# EasyEDA schematic SCH_Grove_Lepton_camera_2022-09-28.json
TITLE: Grove Flir Lepton module; REV: 1.1; Date: 2022-09-28; Sheet: 1/1; Drawn By: Andrew McFarland; Company: McFly Aerospace\n(Andrew McFarland Networking)
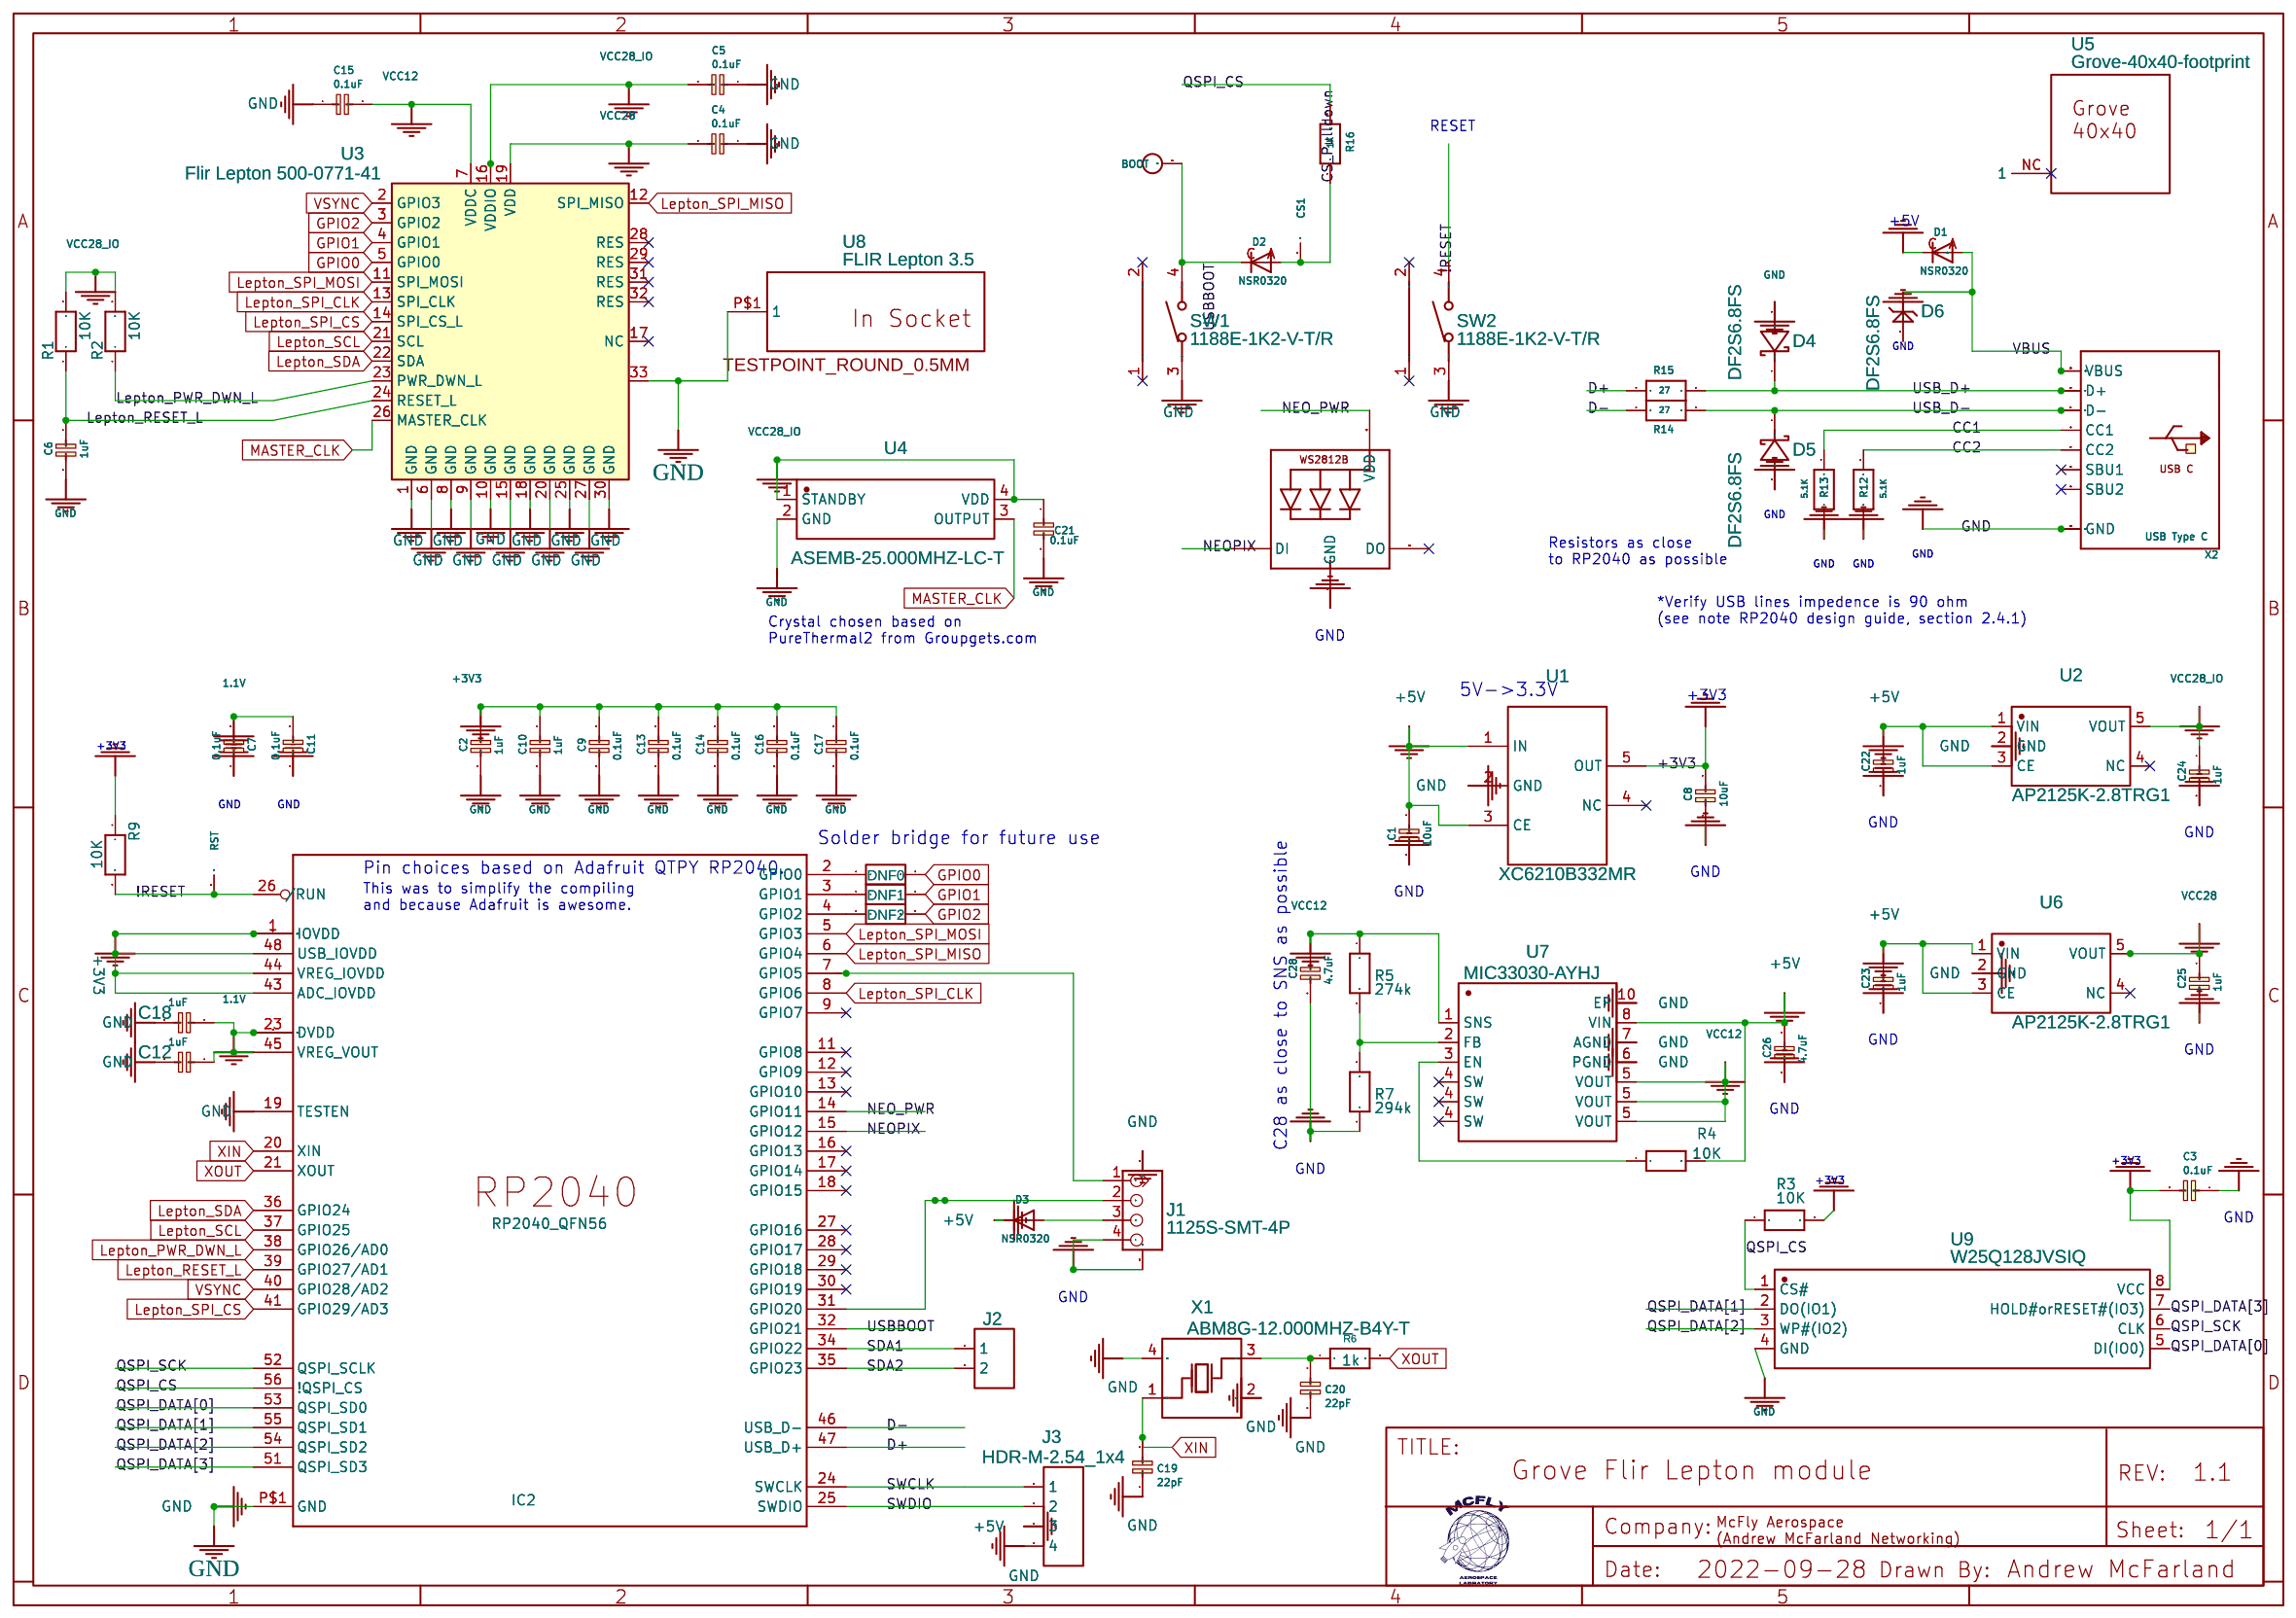
[diagram p0: schematic sheet]

## Parts
BOOT  TESTPOINTROUND1.5MMNO  [TESTPOINT_ROUND_2MM_NO]
C1  10uF  [0805-NO]
C2  1uF  [0603-NO]
C3  0.1uF  [_0402NO]
C4  0.1uF  [_0402NO]
C5  0.1uF  [_0402NO]
C6  1uF  [0603-NO]
C7  0.1uF  [_0402NO]
C8  10uF  [0805-NO]
C9  0.1uF  [_0402NO]
C10  1uF  [0603-NO]
C11  0.1uF  [_0402NO]
C12  1uF  [0603-NO]
C13  0.1uF  [_0402NO]
C14  0.1uF  [_0402NO]
C15  0.1uF  [_0402NO]
C16  0.1uF  [_0402NO]
C17  0.1uF  [_0402NO]
C18  1uF  [0603-NO]
C19  22pF  [_0402NO]
C20  22pF  [_0402NO]
C21  0.1uF  [_0402NO]
C22  1uF  [0603-NO]
C23  1uF  [0603-NO]
C24  1uF  [0603-NO]
C25  1uF  [0603-NO]
C26  4.7uF  [0805-NO]
C28  4.7uF  [0805-NO]
CS1  TESTPOINTROUND1.5MMNO  [TESTPOINT_ROUND_2MM_NO]
D1  NSR0320  [SOD-323]
D2  NSR0320  [SOD-323]
D3  NSR0320  [SOD-323]
D4  DF2S6.8FS  [SOD-923_L0.8-W0.6-LS1.0-RD-1]
D5  DF2S6.8FS  [SOD-923_L0.8-W0.6-LS1.0-RD-1]
D6  DF2S6.8FS  [SOD-923_L0.8-W0.6-LS1.0-BI-2]
DNF0  DNF  [_0402]
DNF1  DNF  [_0402]
DNF2  DNF  [_0402]
IC2  RP2040_QFN56  [QFN56_7MM_REDUCEDEPAD]
J1  1125S-SMT-4P  [HW4-SMD-2.0]
J2  HDR-F-2.54_1x2  [HDR-F-2.54_1X2]
J3  HDR-M-2.54_1x4  [HDR-M-2.54_1X4]
LED1  WS2812B_SK6805_1515  [WS2812B]
R1  10K  [_0402NO]
R2  10K  [_0402NO]
R3  10K  [_0402NO]
R4  10K  [_0402NO]
R5  274k  [_0402NO]
R6  1k  [_0402NO]
R7  294k  [_0402NO]
R9  10K  [_0402NO]
R12  5.1K  [_0402NO]
R13  5.1K  [_0402NO]
R14  27  [0603-MINI]
R15  27  [0603-MINI]
R16  1K  [_0402NO]
RST  TESTPOINTROUND1.5MMNO  [TESTPOINT_ROUND_2MM_NO]
SW1  1188E-1K2-V-T/R  [SW-SMD_1188E]
SW2  1188E-1K2-V-T/R  [SW-SMD_1188E]
U1  XC6210B332MR  [SOT-23-5_L3.0-W1.7-P0.95-LS2.8-BR]
U2  AP2125K-2.8TRG1  [SOT-23-5_L3.0-W1.7-P0.95-LS2.8-BR]
U3  Flir Lepton 500-0771-41  [FLIR_LEPTON_SOCKET_1050281001]
U4  ASEMB-25.000MHZ-LC-T  [OSC-SMD_4P-L3.2-W2.5-BL_ABRACON_ASEMB]
U5  Grove-40x40-footprint  [GROVE-40X40-BOARD]
U6  AP2125K-2.8TRG1  [SOT-23-5_L3.0-W1.7-P0.95-LS2.8-BR]
U7  MIC33030-AYHJ  [QFN-12_L2.5-W2.0-P0.40-TL_MIC33030-AYHJ-TR]
U8  FLIR Lepton 3.5  [TESTPOINT_ROUND_0.5MM]
U9  W25Q128JVSIQ  [SOIC-8_L5.3-W5.3-P1.27-LS8.0-BL]
X1  ABM8G-12.000MHZ-B4Y-T  [CRYSTAL-SMD_4P-L3.2-W2.5-BL]
X2  USB Type C  [USB_C_CUSB31-CFM2AX-01-X]

## Library data of the parts
C1 = -: Supplier: Seeed OPL; Supplier Part: 302010158; Manufacturer: Yageo; Manufacturer Part: CC0805ZKY5V6BB106
C2 = -: Supplier: Seeed OPL; Supplier Part: 302010139; Manufacturer: YAGEO; Manufacturer Part: CC0603KRX7R8BB105
C3 = -: Supplier: Seeed OPL; Supplier Part: 302010004; Manufacturer: YAGEO; Manufacturer Part: CC0402KRX7R7BB104
C20 = -: Supplier: Seeed OPL; Supplier Part: 302010018; Manufacturer: YAGEO; Manufacturer Part: CC0402JRNPO9BN220
C26 = -: Supplier: Seeed OPL; Manufacturer Part: CC0805KKX5R8BB475; Manufacturer: YAGEO; Supplier Part: 302010146
C28 = -: Supplier: Seeed OPL; Supplier Part: 302010146; Manufacturer: YAGEO
D1 = -: Supplier: Digi-Key; Manufacturer: onsemi; Supplier Part: NSR0320MW2T1GOSTR-ND; Manufacturer Part: NSR0320MW2T1G; link: https://www.digikey.cn/short/7tzdmb8c
D2 = -: Supplier: Digi-Key; Supplier Part: NSR0320MW2T1GOSCT-ND; Manufacturer: onsemi; Manufacturer Part: NSR0320MW2T1G; link: https://www.digikey.cn/short/p7r5pnn7
D3 = -: Supplier: Digi-Key; Manufacturer: onsemi; link: https://www.digikey.cn/short/7tzdmb8c; Supplier Part: NSR0320MW2T1GOSCT-ND; Manufacturer Part: NSR0320MW2T1G
D4 = DF2S6.8FS,L3M: Supplier: Seeed OPL; Supplier Part: 304060009; Manufacturer: TOSHIBA(东芝); Contributor: LCSC
D5 = DF2S6.8FS,L3M: Supplier: Seeed OPL; Supplier Part: 304060009; Manufacturer: TOSHIBA(东芝); Contributor: LCSC; link: https://www.mouser.ca/ProductDetail/Toshiba/DF2S6.8FSL3M?qs=eRmS5dli9yOjw7NUk6y8KQ%3D%3D
D6 = D-ESD-2PDF2S6.8FS: SOD-923:304060009;SOD-123:304060001; Supplier: Seeed OPL; Supplier Part: 304060009; Manufacturer: TOSHIBA
DNF0-DNF2 = R_0603_EU: Contributor: LCEDA_Lib
IC2 = -: Supplier: Seeed OPL; Supplier Part: 310011401; Manufacturer: Raspberry Pi; Manufacturer Part: RP2040
J1 = 1125S-SMT-4P: SMD Grove; Manufacturer: Seeed Studio; Supplier: Seeed OPL; Supplier Part: 320110030
J2 = HDR-F-2.54_1x2: Contributor: LCEDA_Lib
J3 = HDR-M-2.54_1x4: Contributor: LCEDA_Lib
LED1 = -: Supplier Part: 304091310; Manufacturer: Worldsemi; Supplier: Seeed OPL; Manufacturer Part: WS2812B-V5
R1 = -: Supplier: Seeed OPL; Manufacturer: YAGEO; Manufacturer Part: RC0402JR-0710KL; Supplier Part: 301010004
R2 R3 R9 = -: Supplier: Seeed OPL; Supplier Part: 301010004; Manufacturer: YAGEO; Manufacturer Part: RC0402JR-0710KL
R4 = -: Supplier: Seeed OPL; Manufacturer Part: RC0402JR-0710KL; Manufacturer: YAGEO; Supplier Part: 301010004
R5 = -: Supplier: ShenZen OPL; Supplier Part: RC0402FR-07274KL; Manufacturer: YAGEO
R6 = -: Supplier: Seeed OPL; Manufacturer Part: RC0402FR-071KL; Manufacturer: YAGEO; Supplier Part: 301010044
R7 = -: Supplier: ShenZen OPL; Supplier Part: RC0402FR-07294KL; Manufacturer: Yageo
R12 = -: Supplier: Seeed OPL; Manufacturer Part: RC0402FR-075K1L; Supplier Part: 301010495; Manufacturer: YAGEO
R13 = -: Manufacturer: YAGEO; Manufacturer Part: RC0402FR-075K1L; Supplier Part: 301010495; Supplier: Seeed OPL
R14 = -: Manufacturer: YAGEO; Supplier: Seeed OPL; Manufacturer Part: RC0603FR-0727RL; Supplier Part: 301011528
R15 = -: Supplier: Seeed OPL; Supplier Part: 301011528; Manufacturer: YAGEO; Manufacturer Part: RC0603FR-0727RL
R16 = -: Manufacturer: YAGEO; Manufacturer Part: RC0402FR-071KL; Supplier Part: 301010044; Supplier: Seeed OPL
SW1 = 1188E-1K2-V-T/R: Supplier: Seeed OPL; Supplier Part: 311020023; Manufacturer: BEST; Contributor: LCSC; JLCPCB Part Class: Extended Part
SW2 = 1188E-1K2-V-T/R: Supplier: Seeed OPL; Supplier Part: 311020023; Manufacturer: Diptronics; Contributor: LCSC; JLCPCB Part Class: Extended Part
U1 = XC6210B332MR: Supplier: ShenZen OPL; Manufacturer: TOREX; Supplier Part: 893-1075-1-ND
U2 = AP2125K-2.8TRG1: Supplier: Digi-Key; Supplier Part: AP2125K-2.8TRG1DICT-ND; Manufacturer: DIODES(美台); Contributor: LCSC; link: https://www.digikey.ca/short/h7r9pdbn
U3 = 500-0643-00: Manufacturer: Molex; Contributor: mike pelletier; Manufacturer Part: 1050281001; Supplier: Digi-Key; link: https://www.digikey.cn/short/3bp81pn2; Supplier Part: WM6827CT-ND
U4 = ASEMB-25.000MHZ-LY-T: Supplier: Digi-Key; Supplier Part: 535-11750-2-ND - 卷带（TR） 535-11750-1-ND; Manufacturer: ABRACON; Manufacturer Part: 535-11750-2-ND - 卷带（TR） 535-11750-1-ND; link: https://www.digikey.cn/zh/products/detail/abracon-llc/ASEMB-25-000MHZ-LC-T/2810004; Contributor: lcsc
U5 = Grove-40x40-footprint: Contributor: andrew26
U6 = AP2125K-2.8TRG1: Supplier: Digi-Key; Supplier Part: AP2125K-2.8TRG1DICT-ND; Manufacturer: DIODES(美台); Contributor: LCSC; link: https://www.digikey.ca/short/jdw2zfbz
U7 = MIC33030-AYHJ-TR: Supplier: Mouser; Supplier Part: 998-MIC33030-AYHJTR; Manufacturer: Microchip Tech; Contributor: LCSC; link: https://mou.sr/3SlIkxG
U8 = lepton: Manufacturer Part: 500-0771-01-ND; Contributor: fcplech; Package Display: Yes; Supplier: Digi-Key; link: https://www.digikey.cn/short/n80ntdbh; Manufacturer: Teledyne Flir; Supplier Part: 500-0771-01
U9 = W25Q128JVSIQ: Supplier: ShenZen OPL; Manufacturer: Winbond Elec; Contributor: LCSC
X1 = ABM8G-12.000MHZ-B4Y-T: Supplier: Digi-Key; Manufacturer: Abracon LLC; Contributor: LCSC; JLCPCB Part Class: Extended Part; link: https://www.digikey.cn/zh/products/detail/abracon-llc/ABM8G-12-000MHZ-B4Y-T/2218029

## Nets
1.1V: C7.2 C11.2 C12.1 C18.1 IC2.23(DVDD) IC2.45(VREG_VOUT) IC2.50(DVDD)
+3V3: C2.1 C3.2 C8.1 C9.1 C10.1 C13.1 C14.1 C16.1 C17.1 IC2.1(IOVDD) IC2.10(IOVDD) IC2.22(IOVDD) IC2.33(IOVDD) IC2.42(IOVDD) IC2.43(ADC_IOVDD) IC2.44(VREG_IOVDD) IC2.48(USB_IOVDD) IC2.49(IOVDD) R3.2 R9.1 U1.5(OUT) U9.8(VCC)
+5V: C1.1 C22.1 C23.1 C26.1 D1.C(Cathode) D3.C J3.3 R4.2 U1.1(IN) U1.3(CE) U2.1(VIN) U2.3(CE) U6.1(VIN) U6.3(CE) U7.8(VIN)
GND: C1.2 C2.2 C3.1 C4.1 C5.1 C6.2 C7.1 C8.2 C9.2 C10.2 C11.1 C12.2 C13.2 C14.2 C15.1 C16.2 C17.2 C18.2 C19.1 C20.2 C21.2 C22.2 C23.2 C24.2 C25.2 C26.2 C28.2 D4.2 D5.2 D6.2(1) IC2.19(TESTEN) IC2.P$1(GND) J1.4 J1.SS1 J1.SS2 J3.4 LED1.3-GND(GND) R7.2 R12.1 R13.1 SW1.3 SW2.3 U1.2(GND) U2.2(GND) U3.1(GND) U3.6(GND) U3.8(GND) U3.9(GND) U3.10(GND) U3.15(GND) U3.18(GND) U3.20(GND) U3.25(GND) U3.27(GND) U3.30(GND) U3.33 U4.2(GND) U6.2(GND) U7.6(PGND) U7.7(AGND) U7.10(EP) U8.P$1(1) U9.4(GND) X1.2(GND) X1.4(GND) X2.A1B12(GND) X2.B1A12(GND)
VBUS: D1.A(Anode) D6.1(2) X2.A4B9(VBUS) X2.B4A9(VBUS)
VCC12: C15.2 C28.1 R5.1 U3.7(VDDC) U7.1(SNS) U7.5(VOUT)
VCC28: C4.2 C25.1 U3.19(VDD) U6.5(VOUT)
VCC28_IO: C5.2 C21.1 C24.1 R1.2 R2.2 U2.5(VOUT) U3.16(VDDIO) U4.1(STANDBY) U4.4(VDD)
!RESET: IC2.26(/RUN) R9.2 RST.P$1 SW2.4
CC1: R13.2 X2.A5(CC1)
CC2: R12.2 X2.B5(CC2)
CS_Pulldown: CS1.P$1 D2.A R16.2
D+: IC2.47(USB_D+) R15.2
D-: IC2.46(USB_D-) R14.2
GPIO0: DNF0.2 U3.5(GPIO0)
GPIO1: DNF1.2 U3.4(GPIO1)
GPIO2: DNF2.2 U3.3(GPIO2)
Lepton_PWR_DWN_L: IC2.38(GPIO26/AD0) R2.1 U3.23(PWR_DWN_L)
Lepton_RESET_L: C6.1 IC2.39(GPIO27/AD1) R1.1 U3.24(RESET_L)
Lepton_SCL: IC2.37(GPIO25) U3.21(SCL)
Lepton_SDA: IC2.36(GPIO24) U3.22(SDA)
Lepton_SPI_CLK: IC2.8(GPIO6) U3.13(SPI_CLK)
Lepton_SPI_CS: IC2.41(GPIO29/AD3) U3.14(SPI_CS_L)
Lepton_SPI_MISO: IC2.6(GPIO4) U3.12(SPI_MISO)
Lepton_SPI_MOSI: IC2.5(GPIO3) U3.11(SPI_MOSI)
MASTER_CLK: U3.26(MASTER_CLK) U4.3(OUTPUT)
NEO_PWR: IC2.14(GPIO11) LED1.1-VDD(VDD)
NEOPIX: IC2.15(GPIO12) LED1.4-DIN(DI)
QSPI_CS: IC2.56(!QSPI_CS) R3.1 R16.1 U9.1(CS#)
QSPI_DATA[0]: IC2.53(QSPI_SD0) U9.5(DI(IO0))
QSPI_DATA[1]: IC2.55(QSPI_SD1) U9.2(DO(IO1))
QSPI_DATA[2]: IC2.54(QSPI_SD2) U9.3(WP#(IO2))
QSPI_DATA[3]: IC2.51(QSPI_SD3) U9.7(HOLD#orRESET#(IO3))
QSPI_SCK: IC2.52(QSPI_SCLK) U9.6(CLK)
SDA1: IC2.34(GPIO22) J2.1
SDA2: IC2.35(GPIO23) J2.2
SWCLK: IC2.24(SWCLK) J3.1
SWDIO: IC2.25(SWDIO) J3.2
USB_D+: D4.1 R15.1 X2.A6(D+) X2.B6(D+)
USB_D-: D5.1 R14.1 X2.A7(D-) X2.B7(D-)
USBBOOT: BOOT.P$1 D2.C IC2.32(GPIO21) SW1.4
VSYNC: IC2.40(GPIO28/AD2) U3.2(GPIO3)
XIN: C19.2 IC2.20(XIN) X1.1(OSC1)
XOUT: IC2.21(XOUT) R6.2
Net-(C20-1): C20.1 R6.1 X1.3(OSC2)
Net-(D3-A): D3.A J1.3
Net-(DNF0-1): DNF0.1 IC2.2(GPIO0)
Net-(DNF1-1): DNF1.1 IC2.3(GPIO1)
Net-(DNF2-1): DNF2.1 IC2.4(GPIO2)
Net-(IC2-7): IC2.7(GPIO5) J1.1
Net-(IC2-31): IC2.31(GPIO20) J1.2
Net-(R4-1): R4.1 U7.3(EN)
Net-(R5-2): R5.2 R7.1 U7.2(FB)

Not connected (* = marked no-connect by the designer): IC2 9(GPIO7)* 11(GPIO8)* 12(GPIO9)* 13(GPIO10)* 16(GPIO13)* 17(GPIO14)* 18(GPIO15)* 27(GPIO16)* 28(GPIO17)* 29(GPIO18)* 30(GPIO19)*; LED1 2-DOUT(DO)*; SW1 1* 2*; SW2 1* 2*; U1 4(NC)*; U2 4(NC)*; U3 17(NC)* 28(RES)* 29(RES)* 31(RES)* 32(RES)*; U5 NC(1)*; U6 4(NC)*; U7 4(SW)*; X2 A8(SBU1)* B8(SBU2)*

## Notes on the sheet
- RESET
- Resistors as close
  to RP2040 as possible
- *Verify USB lines impedence is 90 ohm
  (see note RP2040 design guide, section 2.4.1)
- Crystal chosen based on
  PureThermal2 from Groupgets.com
- 5V->3.3V
- Solder bridge for future use
- Pin choices based on Adafruit QTPY RP2040.
- This was to simplify the compiling
  and because Adafruit is awesome.
- C28 as close to SNS as possible
